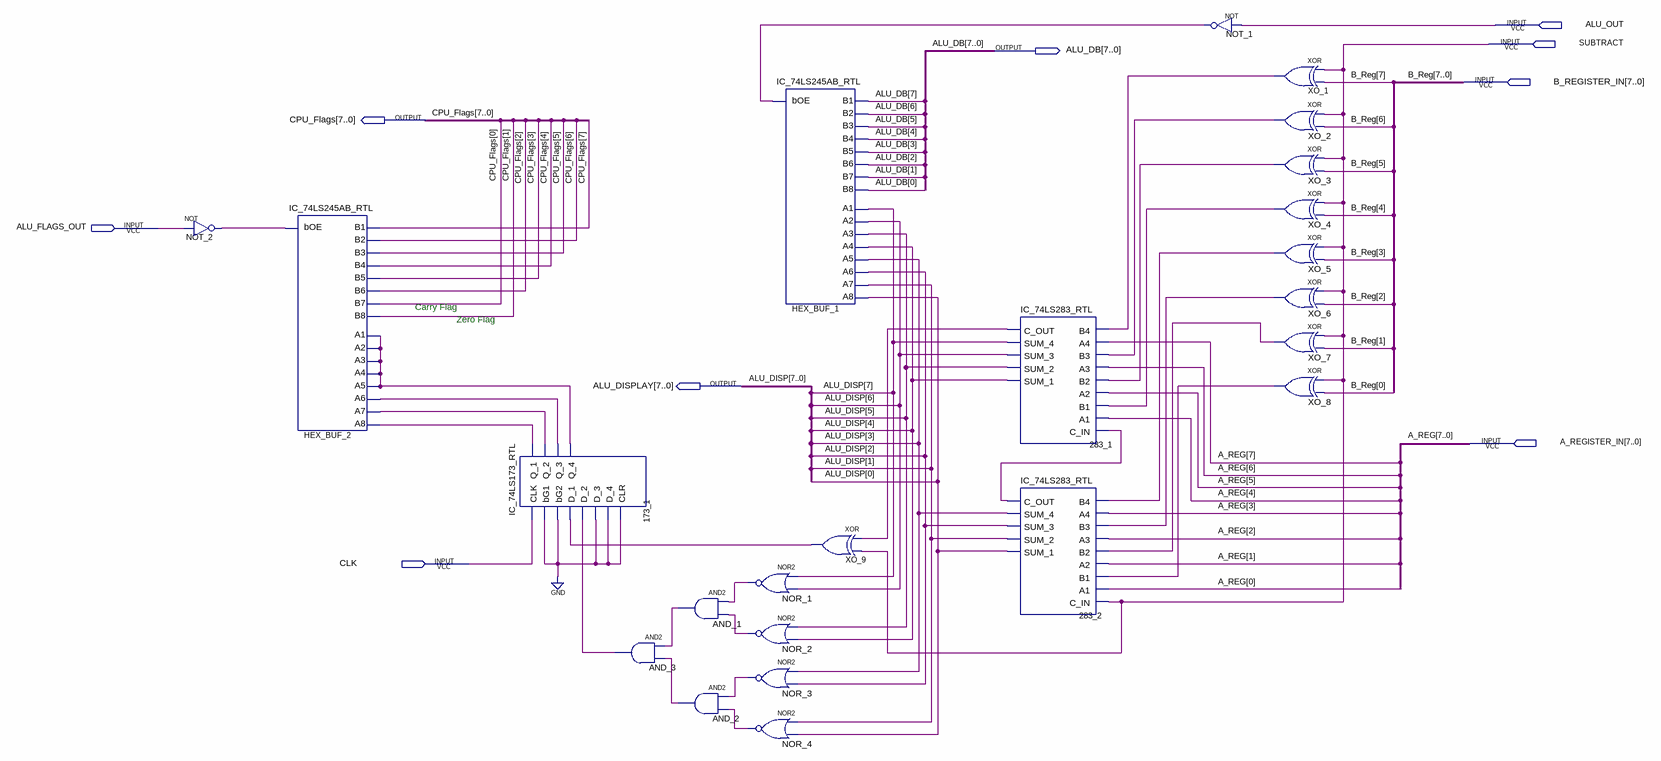
[diagram p0: schematic sheet]
// Quartus schematic ALU.bdf as structural Verilog: 23 symbols, 9 pins
module ALU (
  input  ALU_OUT,
  input  SUBTRACT,
  input  [7:0] B_REGISTER_IN,
  input  ALU_FLAGS_OUT,
  input  [7:0] A_REGISTER_IN,
  input  CLK,
  output [7:0] ALU_DB,
  output [7:0] CPU_Flags,
  output [7:0] ALU_DISPLAY
);

  wire AND_1_out, AND_2_out, AND_3_out, n173_1_q_1, n173_1_q_2, n173_1_q_3, n173_1_q_4, n283_1_c_out,
       n283_2_c_out, NOR_1_out, NOR_2_out, NOR_3_out, NOR_4_out, NOT_1_out, NOT_2_out, XO_1_out, XO_2_out,
       XO_3_out, XO_4_out, XO_5_out, XO_6_out, XO_7_out, XO_8_out, XO_9_out;

  not NOT_2 (NOT_2_out, ALU_FLAGS_OUT);
  IC_74LS245AB_RTL HEX_BUF_2 (
    .bOE(NOT_2_out), .A1(n173_1_q_4), .A2(n173_1_q_4), .A3(n173_1_q_4), .A4(n173_1_q_4), .A5(n173_1_q_4),
    .A6(n173_1_q_3), .A7(n173_1_q_2), .A8(n173_1_q_1), .B1(CPU_Flags[7]), .B2(CPU_Flags[6]),
    .B3(CPU_Flags[5]), .B4(CPU_Flags[4]), .B5(CPU_Flags[3]), .B6(CPU_Flags[2]), .B7(CPU_Flags[0]),
    .B8(CPU_Flags[1]));
  IC_74LS173_RTL u_173_1 (
    .CLK(CLK), .bG1(1'b0), .bG2(1'b0), .D_1(XO_9_out), .D_2(AND_3_out), .D_3(1'b0), .D_4(1'b0), .CLR(1'b0),
    .Q_1(n173_1_q_1), .Q_2(n173_1_q_2), .Q_3(n173_1_q_3), .Q_4(n173_1_q_4));
  and AND_3 (AND_3_out, AND_1_out, AND_2_out);
  and AND_1 (AND_1_out, NOR_1_out, NOR_2_out);
  and AND_2 (AND_2_out, NOR_3_out, NOR_4_out);
  IC_74LS245AB_RTL HEX_BUF_1 (
    .bOE(NOT_1_out), .A1(ALU_DISPLAY[7]), .A2(ALU_DISPLAY[6]), .A3(ALU_DISPLAY[5]), .A4(ALU_DISPLAY[4]),
    .A5(ALU_DISPLAY[3]), .A6(ALU_DISPLAY[2]), .A7(ALU_DISPLAY[1]), .A8(ALU_DISPLAY[0]), .B1(ALU_DB[7]),
    .B2(ALU_DB[6]), .B3(ALU_DB[5]), .B4(ALU_DB[4]), .B5(ALU_DB[3]), .B6(ALU_DB[2]), .B7(ALU_DB[1]),
    .B8(ALU_DB[0]));
  nor NOR_1 (NOR_1_out, ALU_DISPLAY[7], ALU_DISPLAY[6]);
  nor NOR_2 (NOR_2_out, ALU_DISPLAY[5], ALU_DISPLAY[4]);
  nor NOR_3 (NOR_3_out, ALU_DISPLAY[3], ALU_DISPLAY[2]);
  nor NOR_4 (NOR_4_out, ALU_DISPLAY[1], ALU_DISPLAY[0]);
  xor XO_9 (XO_9_out, n283_1_c_out, SUBTRACT);
  IC_74LS283_RTL u_283_1 (
    .B4(XO_1_out), .A4(A_REGISTER_IN[7]), .B3(XO_2_out), .A3(A_REGISTER_IN[6]), .B2(XO_3_out),
    .A2(A_REGISTER_IN[5]), .B1(XO_4_out), .A1(A_REGISTER_IN[4]), .C_IN(n283_2_c_out), .C_OUT(n283_1_c_out),
    .SUM_4(ALU_DISPLAY[7]), .SUM_3(ALU_DISPLAY[6]), .SUM_2(ALU_DISPLAY[5]), .SUM_1(ALU_DISPLAY[4]));
  IC_74LS283_RTL u_283_2 (
    .B4(XO_5_out), .A4(A_REGISTER_IN[3]), .B3(XO_6_out), .A3(A_REGISTER_IN[2]), .B2(XO_7_out),
    .A2(A_REGISTER_IN[1]), .B1(XO_8_out), .A1(A_REGISTER_IN[0]), .C_IN(SUBTRACT), .C_OUT(n283_2_c_out),
    .SUM_4(ALU_DISPLAY[3]), .SUM_3(ALU_DISPLAY[2]), .SUM_2(ALU_DISPLAY[1]), .SUM_1(ALU_DISPLAY[0]));
  not NOT_1 (NOT_1_out, ALU_OUT);
  xor XO_1 (XO_1_out, SUBTRACT, B_REGISTER_IN[7]);
  xor XO_2 (XO_2_out, SUBTRACT, B_REGISTER_IN[6]);
  xor XO_3 (XO_3_out, SUBTRACT, B_REGISTER_IN[5]);
  xor XO_4 (XO_4_out, SUBTRACT, B_REGISTER_IN[4]);
  xor XO_5 (XO_5_out, SUBTRACT, B_REGISTER_IN[3]);
  xor XO_6 (XO_6_out, SUBTRACT, B_REGISTER_IN[2]);
  xor XO_7 (XO_7_out, SUBTRACT, B_REGISTER_IN[1]);
  xor XO_8 (XO_8_out, SUBTRACT, B_REGISTER_IN[0]);

  // Other names for the same wires on the sheet: A_REG[7:0] = A_REGISTER_IN; ALU_DISP[7:0] = ALU_DISPLAY;
  //   B_Reg[7:0] = B_REGISTER_IN

  // Notes on the sheet:
  //   Carry Flag
  //   Zero Flag
endmodule
